# Altium schematic sheet Gyroscope.SchDoc
size A4; SheetNumber: 3; SheetTotal: 4
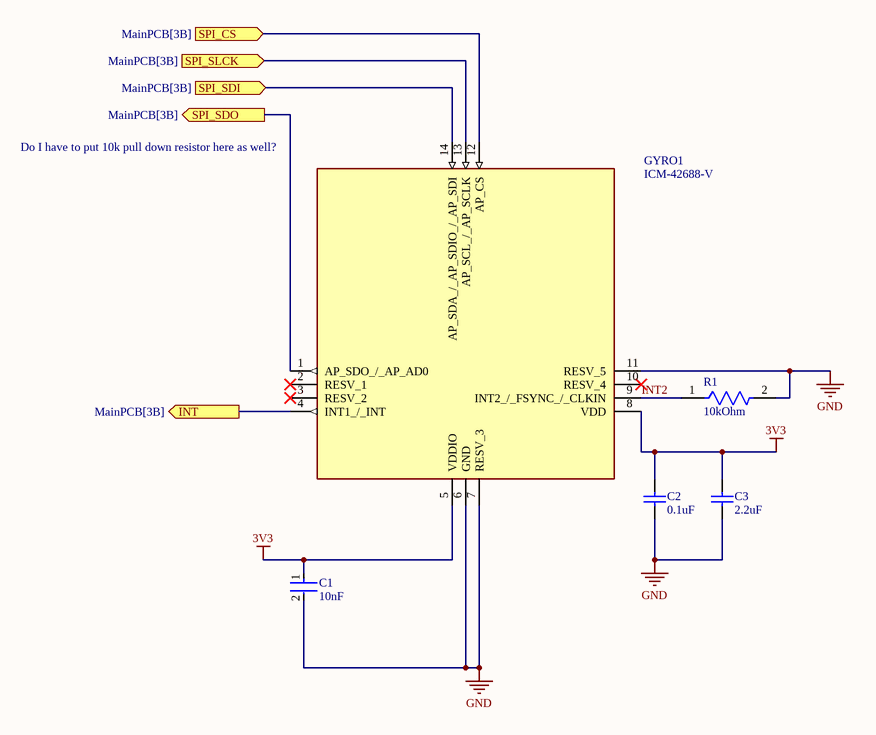
[diagram p0: Gyroscope.SchDoc]

## Parts
C1  10nF  [FP-0402-L_1_0_1-W_0_5_0_1-IPC_C]
C2  0.1uF  [CAPC1005X56X25LL10T15]
C3  2.2uF  [CAPC0603(1608)100_L]
GYRO1  ICM-42688-V  [IIM42352]
R1  10kOhm  [FP-RT0402-MFG]

## Ports
INT (out, see MainPCB[3B]), SPI_CS (in, see MainPCB[3B]), SPI_SDI (in, see MainPCB[3B]), SPI_SDO (out, see MainPCB[3B]), SPI_SLCK (in, see MainPCB[3B])

## Nets
3V3: C1.1 C2.2 C3.1 GYRO1.5(VDDIO) GYRO1.8(VDD)
GND: C1.2 C2.1 C3.2 GYRO1.6(GND) GYRO1.7(RESV_3) GYRO1.11(RESV_5) R1.2
INT: GYRO1.4(INT1_/_INT) ; port INT
INT2: GYRO1.9(INT2_/_FSYNC_/_CLKIN) R1.1
SPI_CS: GYRO1.12(AP_CS) ; port SPI_CS
SPI_SDI: GYRO1.14(AP_SDA_/_AP_SDIO_/_AP_SDI) ; port SPI_SDI
SPI_SDO: GYRO1.1(AP_SDO_/_AP_AD0) ; port SPI_SDO
SPI_SLCK: GYRO1.13(AP_SCL_/_AP_SCLK) ; port SPI_SLCK

Not connected (* = marked no-connect by the designer): GYRO1 2(RESV_1)* 3(RESV_2)* 10(RESV_4)*

## Notes on the sheet
- (near GYRO1) Do I have to put 10k pull down resistor here as well?

## Library data of the parts
C1 = CMP-2008-02516-2: 04023C103KAT2A; Tolerance: 10%; Dielectric: X7R; Voltage: 25V; Dissipation Factor: 12.5%; Insulation Resistance: 100GR; Case Code (Imperial): 0402; Mount: Surface Mount; Package Quantity: 1; Capacitance: 10nF; Lead Free: Lead Free; Series: -; Case Code (Metric): 1005; Termination: SMD/SMT; Voltage Rating (DC): 25V; Case/Package: 0402; Width: 0.02inch; Min Operating Temperature: -55°C; RoHS Compliant: Yes; Height: 0.56mm; Radiation Hardening: No; Depth: 0.5mm; Construction: Flat; Max Operating Temperature: 125°C; Length: 1mm; Voltage Rating: 25V; REACH SVHC: No SVHC; Thickness: 0.022inch; Packaging: Tape and Reel
C2 = CMP-2008-02972-1: 04023C104JAT2A; Manufacturer: AVX Interconnect / Elco; Part Number: 04023C104JAT2A
C3 = CMP-1035-02758-1: C0603C225K8PAC; Rated Voltage: 10 V; Case-EIA: 0603; Case-Metric: 1608; Tolerance: Â±10%; Value: 2.2uF; Max Thickness: 1 mm; Technology: SMT
GYRO1 = ICM-42688-V: Accelerometer; Manufacturer_Name: TDK; Datasheet Link: https://3cfeqx1hf82y3xcoull08ihx-wpengine.netdna-ssl.com/wp-content/uploads/2021/04/DS-000439-ICM-42688-V-v1.1.pdf; Manufacturer_Part_Number: ICM-42688-V; Mouser Part Number: 410-ICM-42688-V; Mouser Price/Stock: https://www.mouser.co.uk/ProductDetail/TDK-InvenSense/ICM-42688-V?qs=iLbezkQI%252Bsj8X%2F1CCh43jQ%3D%3D
R1 = CMP-2002-03023-2: RT0402FRE0710KL; Manufacturer: Yageo; Resistance: 10KΩ; Temperature Coefficient: 50 ppm/°C; Power Rating: 0.063W; Voltage Rating: 50V; Tolerance: 0.01; Value: 10KΩ; Height: 0.35mm; Category: Res; Automotive: No; Manufacturer Part Number: RT0402FRE0710KL; Temperature Range Low: -55°C; Mouser Description: Thin Film Resistors - SMD 1/16W 10K ohm 1% 50ppm; Series: RT; ComponentLink2URL: http://www.yageo.com/documents/recent/PYu-RT_1-to-0.01_RoHS_L_9.pdf; Composition: Thin Film; Ipc Land Pattern Name: RESC10050X30; ComponentLink2Description: Datasheet; Device Class L2: Resistors; Lead Free: Yes; Digikey Description: RES 10.0K OHM 1/16W 1% SMD 0402; Footprint Url: http://www.yageo.com/exep/pages/download/literatures/PYu-R_Mount_10.pdf; RoHS: TRUE; Octopart: https://octopart.com/rt0402fre0710kl-yageo-1293756; Package: RT0402; Device Class L1: Passive Components; Temperature: -55°C to +155°C; Device Class L3: Chip SMD Resistors; Temperature Range High: +155°C